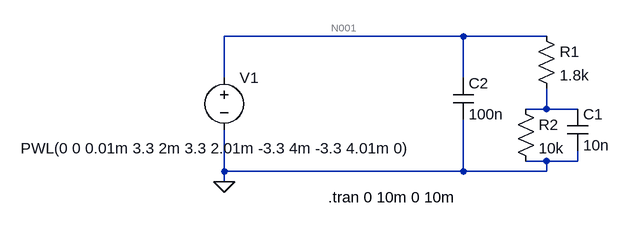
[diagram p0: schematic Draft1.asc]
Draft1.asc, the LTspice schematic file:
Version 4
SHEET 1 880 680
WIRE 80 -32 -288 -32
WIRE 208 -32 80 -32
WIRE -288 32 -288 -32
WIRE 80 32 80 -32
WIRE 208 80 208 48
WIRE 208 80 176 80
WIRE 256 80 208 80
WIRE 208 160 176 160
WIRE 256 160 256 144
WIRE 256 160 208 160
WIRE -288 176 -288 112
WIRE 80 176 80 96
WIRE 80 176 -288 176
WIRE 208 176 208 160
WIRE 208 176 80 176
WIRE -288 192 -288 176
FLAG -288 192 0
SYMBOL res 192 -48 R0
SYMATTR InstName R1
SYMATTR Value 1.8k
SYMBOL res 160 64 R0
SYMATTR InstName R2
SYMATTR Value 10k
SYMBOL cap 240 80 R0
SYMATTR InstName C1
SYMATTR Value 10n
SYMBOL voltage -288 16 R0
WINDOW 3 -313 124 Left 2
WINDOW 123 0 0 Left 0
WINDOW 39 0 0 Left 0
SYMATTR InstName V1
SYMATTR Value PWL(0 0 0.01m 3.3 2m 3.3 2.01m -3.3 4m -3.3 4.01m 0)
SYMBOL cap 64 32 R0
SYMATTR InstName C2
SYMATTR Value 100n
TEXT -128 216 Left 2 !.tran 0 10m 0 10m

The netlist it stands for:
* Draft1.asc
R1 N001 N002 1.8k
R2 N002 0 10k
C1 N002 0 10n
V1 N001 0 PWL(0 0 0.01m 3.3 2m 3.3 2.01m -3.3 4m -3.3 4.01m 0)
C2 N001 0 100n
.tran 0 10m 0 10m
.backanno
.end

* Results of the author's LTspice run, read from the files saved beside the schematic
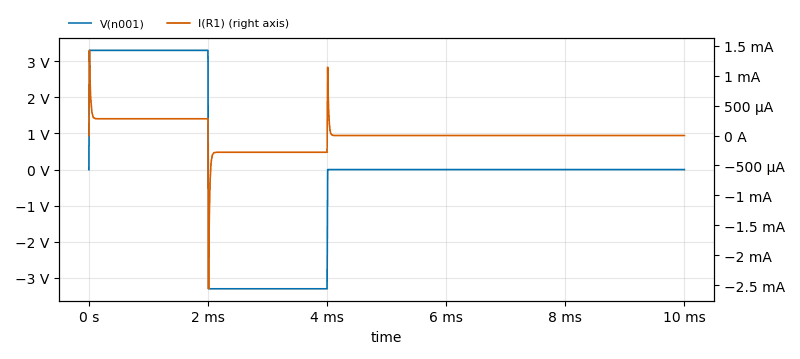
[diagram p1: Transient Analysis of Draft1.asc, plotted from the saved traces]
* Transient Analysis, 1 run:
*   V(n001): min -3.3 V, max 3.3 V, average 0 V, rms 2.085 V, last 0 V
*   I(R1): min -2.56 mA, max 1.422 mA, average 9.367 nA, rms 211.5 µA, last 0 A